# Altium schematic sheet indicator_light.SchDoc: HV Indicator Light
size A4; Organization: Badgerloop; Address1: 133 Engineering Research; Address2: Building; Address3: Madison, WI 53715; Revision: 1; SheetNumber: 3
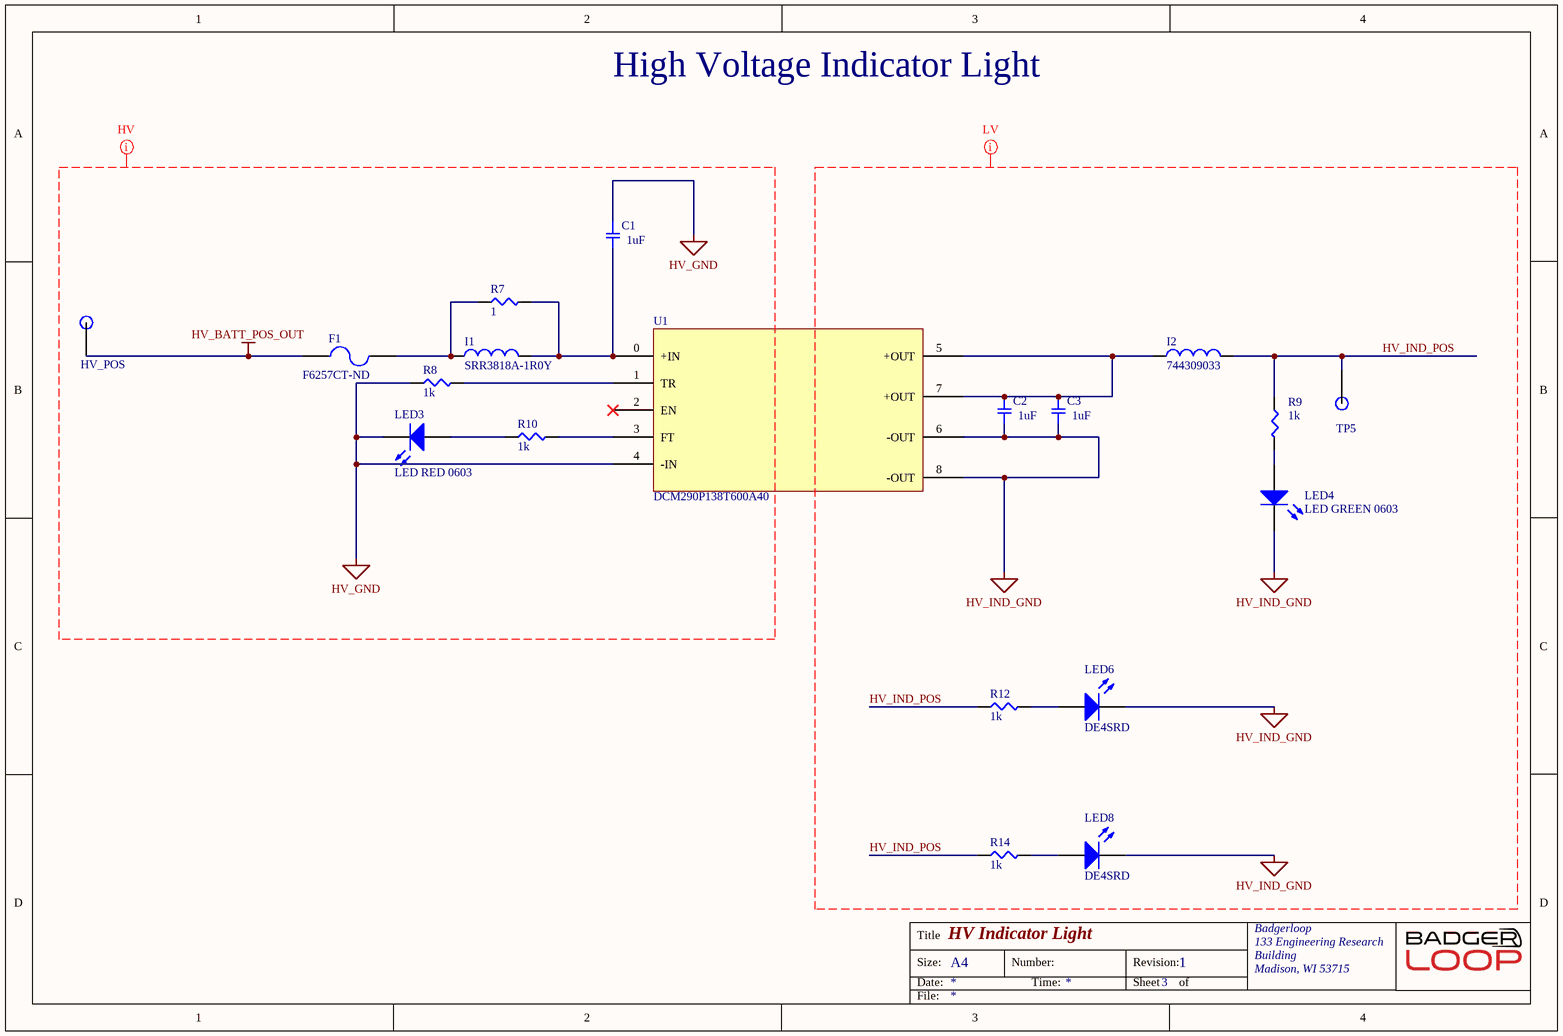
[diagram p0: indicator_light.SchDoc]

## Parts
C1  Capacitance: 1uF  [CAPC5860X28N]  (hidden comment: CGA9P4X7T2W105K250KE_1)
C2  Capacitance: 1uF  [CAPC5860X28N]  (hidden comment: CGA9P4X7T2W105K250KE_1)
C3  Capacitance: 1uF  [CAPC5860X28N]  (hidden comment: CGA9P4X7T2W105K250KE_1)
F1  F6257CT-ND  [SMD-0805-RES]
HV_POS  TP  [Test Point]  (value not drawn)
I1  SRR3818A-1R0Y  [INDM3838X18N]
I2  744309033  [INDM140130X90N]
LED3  LED RED 0603  [LED 0603 RED]
LED4  LED GREEN 0603  [LED 0603 GREEN]
LED6  DE4SRD  [DE4SRD]
LED8  DE4SRD  [DE4SRD]
R7  1  [SMD-0805-RES]
R8  1k  [SMD-0805-RES]
R9  1k  [SMD-0805-RES]
R10  1k  [SMD-0805-RES]
R12  1k  [SMD-0805-RES]
R14  1k  [SMD-0805-RES]
TP5  TP  [Test Point]  (value not drawn)
U1  DCM290P138T600A40  [DCM290y138x600A40]

## Nets
HV_BATT_POS_OUT: F1.1 HV_POS.1
HV_GND: C1.1 LED3.2(K) R8.1 U1.4(-IN)
HV_IND_GND: C2.2 C3.2 LED4.2(K) LED6.2(K) LED8.2(K) U1.6(-OUT) U1.8(-OUT)
HV_IND_POS: I2.2 R9.1 R12.1 R14.1 TP5.1
NetC1_2: C1.2 I1.2 R7.2 U1.0(+IN)
NetC2_1: C2.1 C3.1 I2.1 U1.5(+OUT) U1.7(+OUT)
NetF1_2: F1.2 I1.1 R7.1
NetLED3_1: LED3.1(A) R10.1
NetLED4_1: LED4.1(A) R9.2
NetLED6_1: LED6.1(A) R12.2
NetLED8_1: LED8.1(A) R14.2
NetR8_2: R8.2 U1.1(TR)
NetR10_2: R10.2 U1.3(FT)

Not connected (* = marked no-connect by the designer): U1 2(EN)*

## Layout directives
net class High Voltage: HV_BATT_POS_OUT, HV_GND
net class Low Voltage: HV_IND_GND, HV_IND_POS

## Notes on the sheet
- High Voltage Indicator Light
- Title
- Size:
- Date:
- A4
- Number:
- Time:
- Revision:
- Sheet
- of
- File:

## Library data of the parts
C1-C3 = CGA9P4X7T2W105K250KE_1: CAP CER 1UF 450V X7T 2220; Manufacturer: TDK; Tolerance: 10%; Supplier 1: Digi-Key; Manufacturer Part Number: CGA9P4X7T2W105K250KE; Stock 1: 10698; Pricing 1: 1=3.67, 10=2.957, 100=2.3064 (USD); Mount: Surface Mount; Case/Package: 2220; Weight: 0.016932oz; Case Code (Metric): 5750; Case Code (Imperial): 2220; Min Operating Temperature: -55°C; Max Operating Temperature: 125°C; Voltage Rating: 450V; Packaging: Tape and Reel; Termination: SMD/SMT; Package Quantity: 1; Voltage Rating (DC): 450V; Dielectric: X7T; Features: Soft Termination; Length: 5.7mm; Height: 2.5mm; Width: 0.197inch; Thickness: 0.11inch; Depth: 5mm; Ratings: AEC-Q200; REACH SVHC: No SVHC; ComponentLink1URL: http://www.mouser.com/ds/2/400/lcc_commercial_soft_en-775842.pdf?src-supplier=Mouser; ComponentLink1Description: http://www.mouser.com/ds/2/400/lcc_commercial_soft_en-775842.pdf?src-supplier=Mouser; ComponentLink2URL: http://www.farnell.com/datasheets/1839935.pdf?src-supplier=Element14; ComponentLink2Description: http://www.farnell.com/datasheets/1839935.pdf?src-supplier=Element14; Supplier Part Number 1: 445-8765-6-ND
F1 = F6257CT-ND: FUSE BOARD MNT 500MA 350VAC/VDC; Manufacturer: Littelfuse; Manufacturer P/N: 46205000000; Digikey P/N: F6257CT-ND; Digikey Link: https://www.digikey.com/product-detail/en/littelfuse-inc/46205000000/F6257CT-ND/4331764
HV_POS TP5 = TP: SMD TEST POINT
I1 = SRR3818A-1R0Y: FIXED IND 1UH 3.6A 37 MOHM SMD; Manufacturer: Bourns Inc.; Digikey Link: https://www.digikey.com/product-detail/en/bourns-inc/SRR3818A-1R0Y/SRR3818A-1R0YCT-ND/7556036; Digikey P/N: SRR3818A-1R0YCT-ND; Manufacturer P/N: SRR3818A-1R0Y
I2 = 744309033: FIXED IND 330NH 47.5A 0.165 MOHM; Manufacturer: Wurth; Digikey Link: https://www.digikey.com/product-detail/en/wurth-electronics-inc/744309033/732-3006-1-ND/2626130; Digikey P/N: 732-3006-1-ND; Manufacturer P/N: 744309033
LED3 = LED RED 0603: Red 631nm LED Indication - Discrete 2V 0603 (1608 Metric); Manufacturer: Lite-On Inc.; Manufacturer P/N: LTST-C190KRKT; Digikey P/N: 160-1436-1-ND; Package / Case: 0603; Color: RED
LED4 = LED GREEN 0603: Manufacturer: Lite-On Inc.; Manufacturer P/N: LTST-C190KGKT; Digikey P/N: 160-1435-1-ND; Package / Case: 0603; Color: GREEN
LED6 LED8 = DE4SRD: LED Bars and Arrays Red 640nm 300mcd Diffused Light Bar; Manufacturer: Kingbright; Lens Style: Diffused,Tinted; Voltage Rating: 1.85V; Luminous Intensity: 340mcd; Current: 30mA; Forward Current: 20mA; Power Rating: 75mW; Element Configuration: Single; Supplier 1: Digi-Key; Manufacturer Part Number: DE4SRD; Stock 1: 3382; Pricing 1: 1=2.5, 10=2.217, 100=1.287, 500=1.144, 1000=0.98313, 2500=0.9295 (USD); Mount: Through Hole; Color: Red; Package Quantity: 33; Forward Voltage: 1.85V; Packaging: Rail/Tube; Illumination Color: Red; Lead Free: Lead Free; ComponentLink1URL: http://www.mouser.com/ds/2/216/DE4SRD-69987.pdf?src-supplier=Mouser; ComponentLink1Description: http://www.mouser.com/ds/2/216/DE4SRD-69987.pdf?src-supplier=Mouser; ComponentLink2URL: http://www.kingbrightusa.com/images/catalog/SPEC/DE4SRD.pdf?src-supplier=Digi-Key; ComponentLink2Description: http://www.kingbrightusa.com/images/catalog/SPEC/DE4SRD.pdf?src-supplier=Digi-Key; Supplier Part Number 1: 754-1672-5-ND
R7 = ERJ-6BQJ1R0V: RES SMD 1 OHM 5% 1/3W 0805; Manufacturer: Panasonic Electronic Components; Factory Stock: 0; Unit Price (USD): 0.07603; @ qty: 1500; Power (Watts): 0.333W, 1/3W; Temperature Coefficient: ±200ppm/°C; Part Number: ERJ-6BQJ1R0V; Datasheets: https://industrial.panasonic.com/cdbs/www-data/pdf/RDA0000/AOA0000C239.pdf; Image: //media.digikey.com/Renders/Panasonic%20Renders/ERJ-0805%20Pkg.jpg; Digi-Key Part Number: P17527CT-ND; Quantity Available: 4990; Minimum Quantity: 1; Packaging: Cut Tape (CT); Series: ERJ; Part Status: Active; Value: 1; Tolerance: ±5%; Composition: Thick Film; Features: Automotive AEC-Q200, Current Sense; Operating Temperature: -55°C ~ 125°C; Package / Case: 0805 (2012 Metric); Supplier Device Package: 0805; Size / Dimension: 0.079" L x 0.049" W (2.00mm x 1.25mm); Height - Seated (Max): 0.028" (0.70mm); Number of Terminations: 2; Failure Rate: -
R8-R10 R12 R14 = ERJ-6ENF1001V: RES SMD 1K OHM 1% 1/8W 0805; Manufacturer: Panasonic Electronic Components; Factory Stock: 0; Unit Price (USD): 0.00729; @ qty: 1500; Minimum Quantity: 1; Power (Watts): 0.125W, 1/8W; Temperature Coefficient: ±100ppm/°C; Part Number: ERJ-6ENF1001V; Datasheets: http://industrial.panasonic.com/www-cgi/jvcr13pz.cgi?E+PZ+3+AOA0002+ERJ6ENF1001V+7+WW; Image: //media.digikey.com/Renders/Panasonic%20Renders/ERJ-0805%20Pkg.jpg; Digi-Key Part Number: P1.00KCCT-ND; Quantity Available: 12895103; Packaging: Cut Tape (CT); Series: ERJ; Part Status: Active; Value: 1k; Tolerance: ±1%; Composition: Thick Film; Features: Automotive AEC-Q200; Operating Temperature: -55°C ~ 155°C; Package / Case: 0805 (2012 Metric); Supplier Device Package: 0805; Size / Dimension: 0.079" L x 0.049" W (2.00mm x 1.25mm); Height - Seated (Max): 0.028" (0.70mm); Number of Terminations: 2; Failure Rate: -
U1 = DCM290P138T600A40: DC DC CONVERTER 13.8V 600W; Manufacturer: Vicor; Manufacturer P/N: DCM290P138T600A40; Digikey Link: https://www.digikey.com/product-detail/en/vicor-corporation/DCM290P138T600A40/1102-5388-ND/4860626; Digikey P/N: 1102-5388-ND